# Altium schematic sheet Magnetometer.SchDoc
size A; SheetNumber: 6; SheetTotal: 6
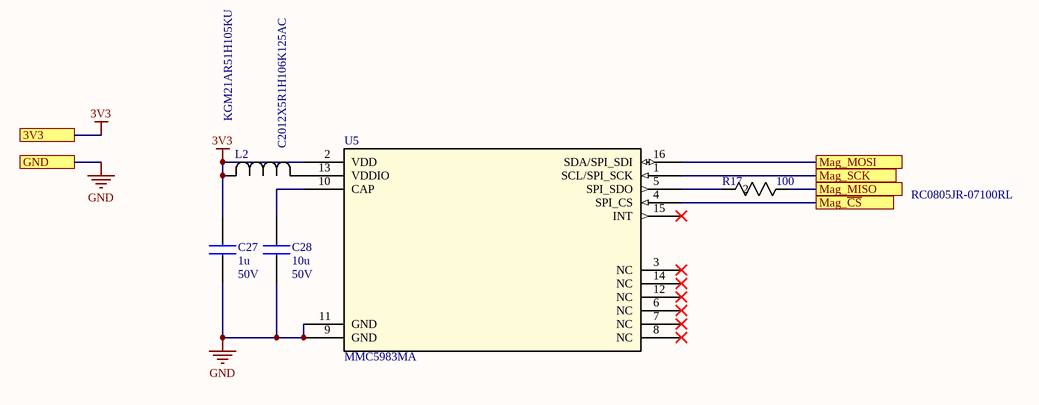
[diagram p0: Magnetometer.SchDoc]

## Parts
C27  KGM21AR51H105KU  value 1u  Rated Voltage: 50V  [CAPC2012X145N]
C28  C2012X5R1H106K125AC  value 10u  Rated Voltage: 50V  [CAPC2012X145N]
L2  MPZ2012S601AT000  [IND_2012_TDK]  (value not drawn)
R17  RC0805JR-07100RL  value 100  [RC0805N_YAG]
U5  MMC5983MA  [MMC5983MA_MEM]

## Ports
3V3, GND, Mag_MISO, Mag_MOSI, Mag_SCK, Mag_~{CS}

## Nets
3V3: C27.2 L2.2 U5.2(VDD) ; port 3V3
GND: C27.1 C28.1 U5.9(GND) U5.11(GND) ; port GND
Mag_~{CS}: U5.4(SPI_CS) ; port Mag_~{CS}
Mag_MISO: R17.1 ; port Mag_MISO
Mag_MOSI: U5.16(SDA/SPI_SDI) ; port Mag_MOSI
Mag_SCK: U5.1(SCL/SPI_SCK) ; port Mag_SCK
NetC28_2: C28.2 U5.10(CAP)
NetL2_1: L2.1 U5.13(VDDIO)
NetR17_2: R17.2 U5.5(SPI_SDO)

Not connected (* = marked no-connect by the designer): U5 3(NC)* 6(NC)* 7(NC)* 8(NC)* 12(NC)* 14(NC)* 15(INT)*

## Library data of the parts
C27 = KGM21AR51H105KU: Multilayer Ceramic Chip Capacitors, Capacitance=1u; Manufacturer_Part_Number: KGM21AR51H105KU
C28 = C2012X5R1H106K125AC: Multilayer Ceramic Chip Capacitors, Capacitance=10?F, LxWxT:2x1.25x1.25mm; Manufacturer_Name: TDK; Geometry.Height: 1.45mm; Mouser Part Number: 810-C2012X5R1H106K12; Mouser Price/Stock: https://www.mouser.co.uk/ProductDetail/TDK/C2012X5R1H106K125AC?qs=rSMjJ%252B1ewcQGpfDVduhUmg%3D%3D; Manufacturer_Part_Number: C2012X5R1H106K125AC; Datasheet Link: https://product.tdk.com/info/en/catalog/datasheets/mlcc_commercial_midvoltage_en.pdf
L2 = MPZ2012S601AT000: No Description Available; Manufacturer_Name: TDK; Copyright: Copyright (C) 2025 Ultra Librarian. All rights reserved.; Manufacturer_Part_Number: MPZ2012S601AT000
R17 = RC0805JR-07100RL: RES 0805 100 5% 1/8W; Manufacturer_Name: Yageo; Manufacturer_Part_Number: RC0805JR-07100RL; Tolerance: 5%
U5 = MMC5983MA: No Description Available; Manufacturer_Name: Memsic; Copyright: Copyright (C) 2025 Ultra Librarian. All rights reserved.; Manufacturer_Part_Number: MMC5983MA; RefDes: RefDes; Type: Type